# EAGLE design PolluxSensorSound (EAGLE 6.1)
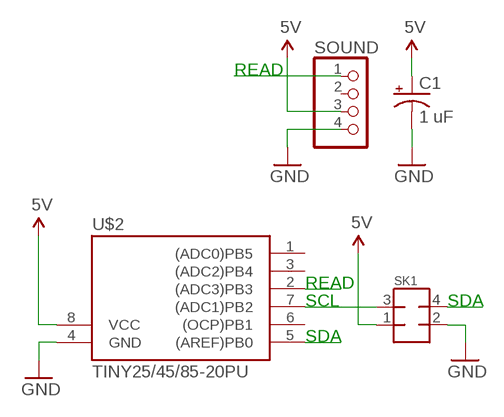
[diagram p0: schematic, sheet 1]

## Parts
C1  1 uF  CAP_POLPTH2  [CPOL-RADIAL-10UF-25V]
SK1  MMATCH-8-PTH  [AMP-215079-8]
SOUND  PINHD-1X04_2.00  [1X04M]
U$2  TINY25/45/85-20PU  [DIL08]

## Nets
5V: C1.1(+) SK1.1 SOUND.3 U$2.8(VCC)
GND: C1.2(-) SK1.2 SOUND.4 U$2.4(GND)
N$2: SK1.3 U$2.7((ADC1)PB2)
READ: SOUND.1 U$2.2((ADC3)PB3)
SDA: SK1.4 U$2.5((AREF)PB0)
Unconnected: SOUND.2 U$2.1((ADC0)PB5) U$2.3((ADC2)PB4) U$2.6((OCP)PB1)

## Notes on the sheet
- READ
- READ
- SCL | SDA
- SDA

## Library data of the parts
C1 = SparkFun:CAP_POL: Capacitor Polarized These are standard SMD and PTH capacitors. Normally 10uF, 47uF, and 100uF in electrolytic and tantalum varieties. Always verify the external diameter of the through hole cap, it varies with capacity, voltage, and manufacturer. The EIA devices should be standard.
SK1 = jt-con-micromatch:MMATCH-8-*: AMP Micromatch 8-pin
SOUND = pinhead-2:PINHD-1X04: PIN HEADER
U$2 = avr-7:TINY25/45/85

## Board
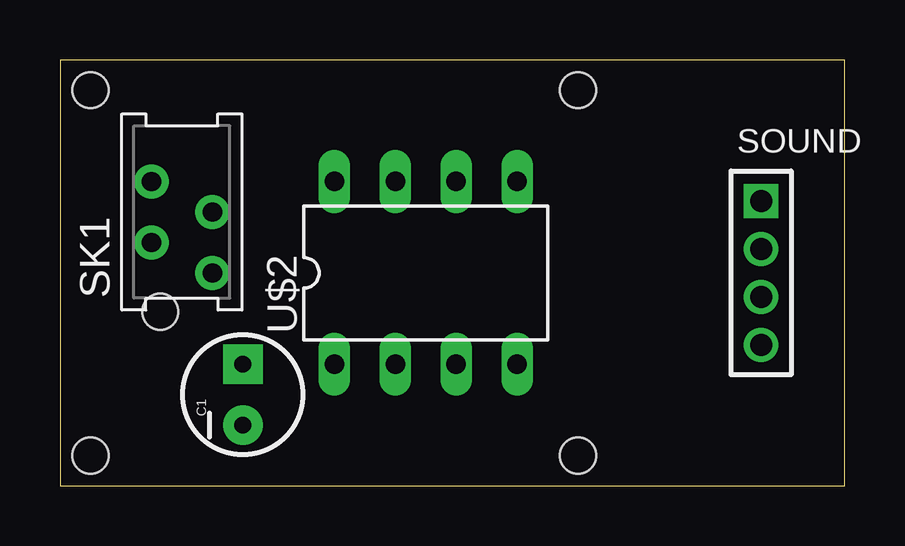
[diagram p1: board, top side]
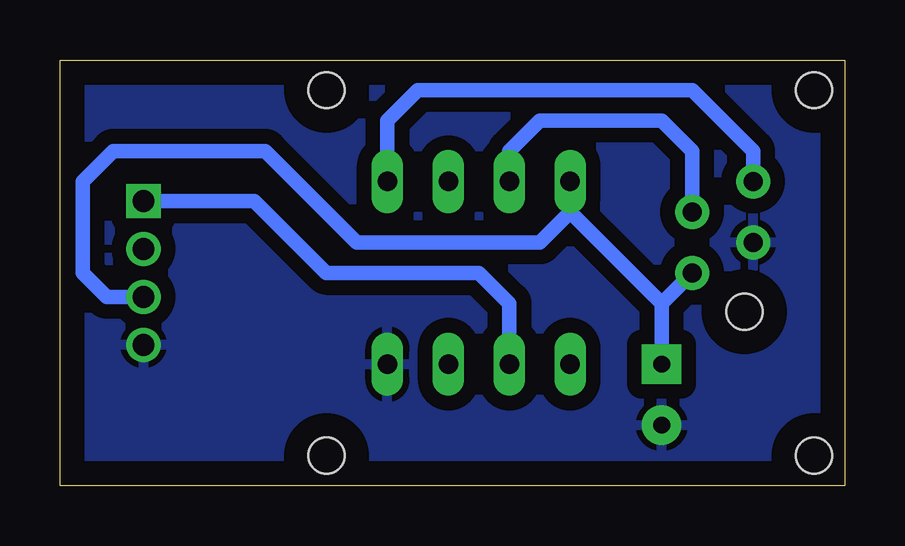
[diagram p2: board, bottom side, seen from below]

Size 32.69 x 17.77 mm. Coordinates in mm from the lower left corner, seen from the top.
Outline: 0,0 32.69,0 32.69,17.77 0,17.77 0,0
Copper layers (1*16): Top 0.035mm / dielectric 1.5mm / Bottom 0.035mm
Design rules: minimum track width 24mil, minimum drill 24mil, track to track 24mil, track to pad 24mil, pad to pad 8mil, via to via 8mil, smd to smd 8mil, copper to edge 40mil, drill to drill 8mil, minimum pad ring 10mil, minimum via ring 8mil, stop-mask expansion 4mil, vias tented up to drill 0mil, thermal gap 10mil
Holes 1.5 mm at 1.27,16.51 1.27,1.27 21.59,1.27 21.59,16.51

### Footprints (pad centres in the part's own frame; a part is rotated, then mirrored left to right if it is on the bottom)
CPOL-RADIAL-10UF-25V = drill 0.7 pad 1.651 square: 1 1.27,0 | drill 0.7 pad 1.651: 2 -1.27,0
AMP-215079-8 = drill 0.8 pad 1.422: 1 0,-1.27; 2 1.27,1.27; 3 2.54,-1.27; 4 3.81,1.27 | hole 1.5: -1.62,0.905
1X04M = drill 0.914 square: 1 -3,0 | drill 0.914: 2 -1,0; 3 1,0; 4 3,0
DIL08 = drill 0.813 long: 1 -3.81,-3.81; 2 -1.27,-3.81; 3 1.27,-3.81; 4 3.81,-3.81; 5 3.81,3.81; 6 1.27,3.81; 7 -1.27,3.81; 8 -3.81,3.81

### Placement (x,y rotation side)
C1  7.62,3.81 90 top
SK1  5.08,8.89 90 top
SOUND  29.21,8.89 270 top
U$2  15.24,8.89 0 top

### Tracks (layer width: path | path; a pad name or v marks a point on that pad's centre or on a via)
5V
  Bottom 0.61: SK1.1 7.62,7.62 | 7.62,7.62 11.43,11.43 | 11.43,11.43 U$2.8 | C1.1 7.62,7.62 | 11.43,11.43 12.7,10.16 20.32,10.16 24.13,13.97 30.48,13.97 31.75,12.7 31.75,8.89 30.75,7.89 SOUND.3
GND
  pour Bottom: 0,17.78 33.02,17.78 33.02,0 0,0
N$2
  Bottom 0.61: SK1.3 6.35,13.97 7.62,15.24 12.7,15.24 13.97,13.97 U$2.7
READ
  Bottom 0.61: SOUND.1 24.59,11.89 21.59,8.89 15.24,8.89 13.97,7.62 U$2.2
SDA
  Bottom 0.61: SK1.4 3.81,13.97 6.35,16.51 17.78,16.51 19.05,15.24 U$2.5